# Altium project POP.PrjPcb
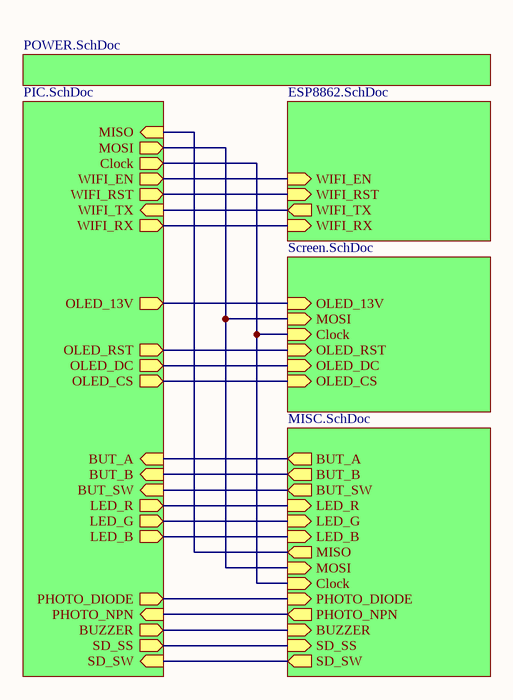
[diagram p0: Root.SchDoc]
6 sheets, 94 parts. Net scope: hierarchical (ports join the sheet entries above them; power ports are global).
Board file: ultratron_PCB.PcbDoc
Sheets:
  Root.SchDoc
     = ESP8862.SchDoc
     = MISC.SchDoc
     = PIC.SchDoc
     = POWER.SchDoc
     = Screen.SchDoc

## Sheet Root.SchDoc
size A4; SheetNumber: 0

### Sub-sheets
? = ESP8862.SchDoc: WIFI_TX (out), WIFI_RX (in), WIFI_RST (in), WIFI_EN (in)
? = MISC.SchDoc: BUT_A (out), BUT_B (out), BUT_SW (out), LED_R (in), LED_G (in), LED_B (in), SD_SS (in), MISO (out), MOSI (in), Clock (in), PHOTO_DIODE (in), PHOTO_NPN (out), BUZZER (in), SD_SW (out)
? = PIC.SchDoc: OLED_RST (out), OLED_13V (out), BUZZER (out), MISO (in), MOSI (out), SD_SS (out), OLED_DC (out), OLED_CS (out), WIFI_RST (out), LED_R (out), LED_B (out), LED_G (out), PHOTO_DIODE (out), BUT_A (in), SD_SW (in), Clock (out), BUT_SW (in), BUT_B (in), WIFI_RX (out), WIFI_TX (in), PHOTO_NPN (in), WIFI_EN (out)
? = POWER.SchDoc: no entries
? = Screen.SchDoc: OLED_13V (in), MOSI (in), Clock (in), OLED_RST (in), OLED_CS (in), OLED_DC (in)

### Nets
PIC_RX: sheet /WIFI_TX, sheet /WIFI_TX
PIC_TX: sheet /WIFI_RX, sheet /WIFI_RX
NetA1_1: sheet /PHOTO_NPN, sheet /PHOTO_NPN
NetC25_2: sheet /BUT_SW, sheet /BUT_SW
NetC26_2: sheet /BUT_A, sheet /BUT_A
NetC27_2: sheet /BUT_B, sheet /BUT_B
NetDS1_8: sheet /OLED_CS, sheet /OLED_CS
NetDS1_9: sheet /OLED_RST, sheet /OLED_RST
NetDS1_10: sheet /OLED_DC, sheet /OLED_DC
NetDS1_13: sheet /Clock, sheet /Clock, sheet /Clock
NetDS1_14: sheet /MOSI, sheet /MOSI, sheet /MOSI
NetJ2_2: sheet /SD_SS, sheet /SD_SS
NetJ2_7: sheet /MISO, sheet /MISO
NetJ2_SWA: sheet /SD_SW, sheet /SD_SW
NetQ1_1: sheet /OLED_13V, sheet /OLED_13V
NetQ3_1: sheet /LED_R, sheet /LED_R
NetQ4_1: sheet /LED_G, sheet /LED_G
NetQ5_1: sheet /LED_B, sheet /LED_B
NetQ6_1: sheet /BUZZER, sheet /BUZZER
NetQ7_1: sheet /PHOTO_DIODE, sheet /PHOTO_DIODE
NetR19_1: sheet /WIFI_RST, sheet /WIFI_RST
NetR21_1: sheet /WIFI_EN, sheet /WIFI_EN

## Sheet ESP8862.SchDoc
size A4; SheetNumber: 3
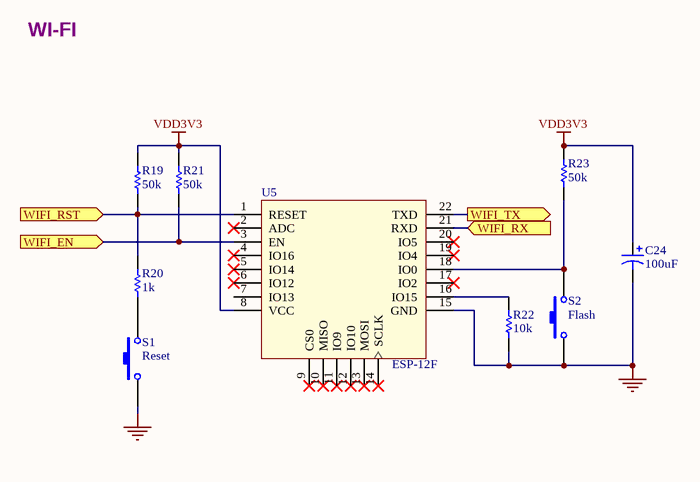
[diagram p1: ESP8862.SchDoc]

### Parts
C24  100uF  [AVX-B_TANTALUM-SMD-100UF-6.3V(AVX-B)(Primary)]
R19  50k  [RESC1608X55N]
R20  1k  [RESC1608X55N]
R21  50k  [RESC1608X55N]
R22  10k  [RESC1608X55N]
R23  50k  [RESC1608X55N]
S1  Reset  [SWITCH_4x6]
S2  Flash  [SWITCH_4x6]
U5  ESP-12F  [ESP_12_E]

### Ports
WIFI_EN (in), WIFI_RST (in), WIFI_RX (in), WIFI_TX (out)

### Nets
GND: C24.2 R22.1 S1.1 S2.1 U5.15(GND)
VDD3V3: C24.1 R19.2 R21.2 R23.2 U5.8(VCC)
PIC_RX: U5.22(TXD) ; port WIFI_TX
PIC_TX: U5.21(RXD) ; port WIFI_RX
NetR19_1: R19.1 R20.2 U5.1(RESET) ; port WIFI_RST
NetR20_1: R20.1 S1.2
NetR21_1: R21.1 U5.3(EN) ; port WIFI_EN
NetR22_2: R22.2 U5.16(IO15)
NetR23_1: R23.1 S2.2 U5.18(IO0)

Not connected (* = marked no-connect by the designer): U5 2(ADC)* 4(IO16)* 5(IO14)* 6(IO12)* 7(IO13) 9(CS0)* 10(MISO)* 11(IO9)* 12(IO10)* 13(MOSI)* 14(SCLK)* 17(IO2)* 19(IO4)* 20(IO5)*

### Notes on the sheet
- WI-FI

### Library data of the parts
C24 = Cap Pol2: Polarized Capacitor (Axial); Fabricant: AVX; Fabricant_REF: TAJB107M006RNJ; Fournisseur: Farnell; Fournisseur_REF: 1833917; Price: 0.914
R19-R21 R23 = Resistor: Fabricant: MULTICOMP; Fournisseur: Farnell
R22 = Resistor: Value: 1K; Published: 8-Jun-2000; LatestRevisionDate: 17-Jul-2002; LatestRevisionNote: Re-released for DXP Platform.; PackageReference: AXIAL-0.3; Publisher: Altium Limited; PackageDescription: Axial Device, Thru-Hole; 2 Leads; 0.3 in Pin Spacing
S1 S2 = SW-PB: Switch; Fabricant: FGHGF; Fabricant_REF: 1158238; Fournisseur: Aliexpress; Fournisseur_REF: 32788506240; Price: 0.0211
U5 = ESP-12F: Fabricant: ESPRESSIF; Fournisseur: Aliexpress; Fournisseur_REF: 32858988324; Price: 1.6; Fabricant_REF: ESP-12F

## Sheet MISC.SchDoc
size A4; SheetNumber: 5
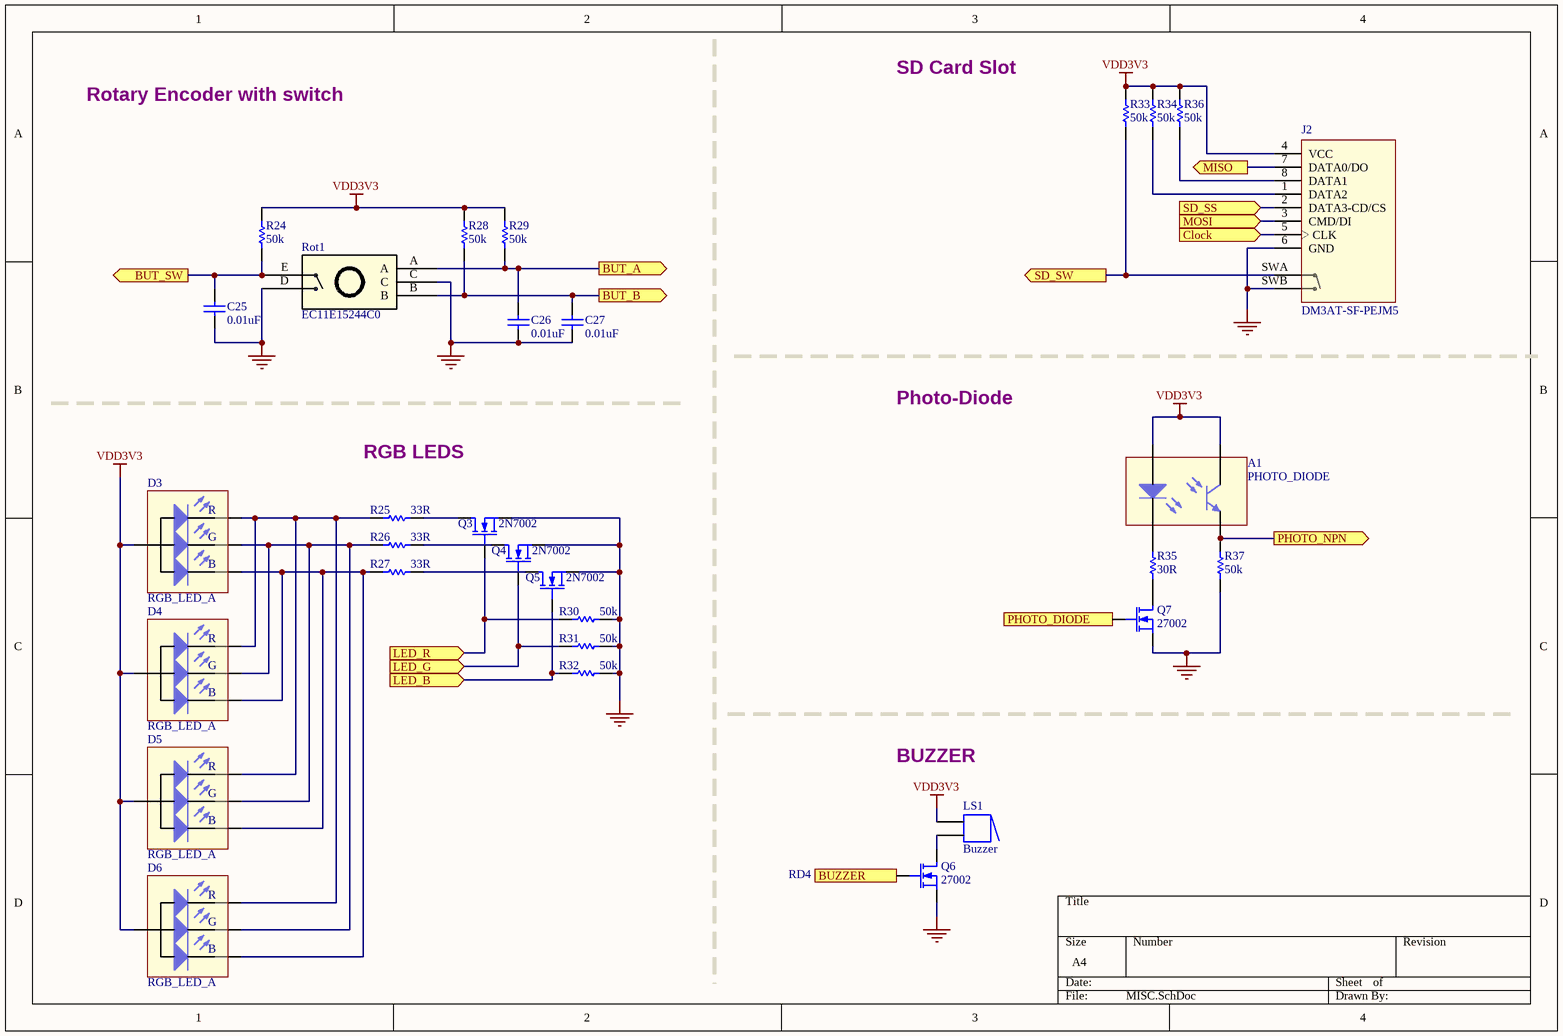
[diagram p2: MISC.SchDoc]

### Parts
A1  PHOTO_DIODE  [TCRT5000]
C25  0.01uF  [CAPC1608X90N]
C26  0.01uF  [CAPC1608X90N]
C27  0.01uF  [CAPC1608X90N]
D3  RGB_LED_A  [RGB_LED]
D4  RGB_LED_A  [RGB_LED]
D5  RGB_LED_A  [RGB_LED]
D6  RGB_LED_A  [RGB_LED]
J2  DM3AT-SF-PEJM5  [HRS_DM3AT-SF-PEJM5_DM3AT-SF-PEJM5(Primary)]
LS1  Buzzer  [ABT-460-RC]
Q3  2N7002  [SOT23-3]
Q4  2N7002  [SOT23-3]
Q5  2N7002  [SOT23-3]
Q6  27002  [SOT23-3]
Q7  27002  [SOT23-3]
R24  50k  [RESC1608X55N]
R25  33R  [RESC1608X55N]
R26  33R  [RESC1608X55N]
R27  33R  [RESC1608X55N]
R28  50k  [RESC1608X55N]
R29  50k  [RESC1608X55N]
R30  50k  [RESC1608X55N]
R31  50k  [RESC1608X55N]
R32  50k  [RESC1608X55N]
R33  50k  [RESC1608X55N]
R34  50k  [RESC1608X55N]
R35  30R  [RESC1608X55N]
R36  50k  [RESC1608X55N]
R37  50k  [RESC1608X55N]
Rot1  EC11E15244C0  [EC11E15244C0]

### Ports
BUT_A (out), BUT_B (out), BUT_SW (out), BUZZER (in), Clock (in), LED_B (in), LED_G (in), LED_R (in), MISO (out), MOSI (in), PHOTO_DIODE (in), PHOTO_NPN (out), SD_SS (in), SD_SW (out)

### Nets
GND: C25.1 C26.1 C27.1 J2.6(GND) J2.SWB(B) Q3.2(S) Q4.2(S) Q5.2(S) Q6.2(S) Q7.2(S) R30.2 R31.2 R32.2 R37.1 Rot1.C Rot1.D(Switch)
VDD3V3: A1.2 A1.3 D3.2(Cathode) D4.2(Cathode) D5.2(Cathode) D6.2(Cathode) J2.4(VCC) LS1.1 R24.2 R28.2 R29.2 R33.2 R34.2 R36.2
NetA1_1: A1.1 R37.2 ; port PHOTO_NPN
NetA1_4: A1.4 R35.2
NetC25_2: C25.2 R24.1 Rot1.E(Switch) ; port BUT_SW
NetC26_2: C26.2 R29.1 Rot1.A ; port BUT_A
NetC27_2: C27.2 R28.1 Rot1.B ; port BUT_B
NetD3_1: D3.1(R) D4.1(R) D5.1(R) D6.1(R) R25.1
NetD3_3: D3.3(G) D4.3(G) D5.3(G) D6.3(G) R26.1
NetD3_4: D3.4(B) D4.4(B) D5.4(B) D6.4(B) R27.1
NetDS1_13: J2.5(CLK) ; port Clock
NetDS1_14: J2.3(CMD/DI) ; port MOSI
NetJ2_1: J2.1(DATA2) R34.1
NetJ2_2: J2.2(DATA3-CD/CS) ; port SD_SS
NetJ2_7: J2.7(DATA0/DO) ; port MISO
NetJ2_8: J2.8(DATA1) R36.1
NetJ2_SWA: J2.SWA(A) R33.1 ; port SD_SW
NetLS1_2: LS1.2 Q6.3(D)
NetQ3_1: Q3.1(G) R30.1 ; port LED_R
NetQ3_3: Q3.3(D) R25.2
NetQ4_1: Q4.1(G) R31.1 ; port LED_G
NetQ4_3: Q4.3(D) R26.2
NetQ5_1: Q5.1(G) R32.1 ; port LED_B
NetQ5_3: Q5.3(D) R27.2
NetQ6_1: Q6.1(G) ; port BUZZER
NetQ7_1: Q7.1(G) ; port PHOTO_DIODE
NetQ7_3: Q7.3(D) R35.1

### Notes on the sheet
- Rotary Encoder with switch
- SD Card Slot
- Photo-Diode
- RGB LEDS
- BUZZER
- RD4

### Library data of the parts
A1 = PHOTO_DIODE: Photo-diode; Fabricant: VISHAY; Fournisseur: Farnell; Fournisseur_REF: 1470066; Fabricant_REF: TCRT5000; Price: 0.7
C25-C27 = Capacitor: Value: 100pF; Published: 8-Jun-2000; LatestRevisionDate: 17-Jul-2002; LatestRevisionNote: Re-released for DXP Platform.; PackageReference: RAD-0.3; Publisher: Altium Limited; PackageDescription: Radial Cap, Thru-Hole; 2 Leads; 0.3 in Pin Spacing
D3-D6 = RGB_LED_A: RGB_LED Common Anode; Fournisseur: Aliexpress; Price: 0.004
J2 = DM3AT-SF-PEJM5: DM3 RA SMT microSD memory card push/push; Fabricant: HIROSE(HRS); Fournisseur: Farnell; Fournisseur_REF: 1764374; Fabricant_REF: DM3AT-SF-PEJM5(40); Price: 2.64
LS1 = Buzzer: Magnetic Transducer Buzzer; Fabricant: PRO SIGNAL; Fournisseur: Farnell; Fournisseur_REF: 2783902; Price: 1.55; Fabricant_REF: ABT-460-RC
Q3-Q7 = MOSFET-N: N-Channel MOSFET; Fabricant: NEXPERIA; Fournisseur: Farnell; Fournisseur_REF: 1859847; Fabricant_REF: 2N7002BK; Price: 0.196
R24-R37 = Resistor: as R19 on sheet ESP8862
Rot1 = EC11E15244C0: Rotary Encoder; Fabricant: ALPS; Fournisseur: Farnell; Fournisseur_REF: 1520806; Price: 3.32; Fabricant_REF: EC11E15244C0

## Sheet PIC.SchDoc
size A4; SheetNumber: 1
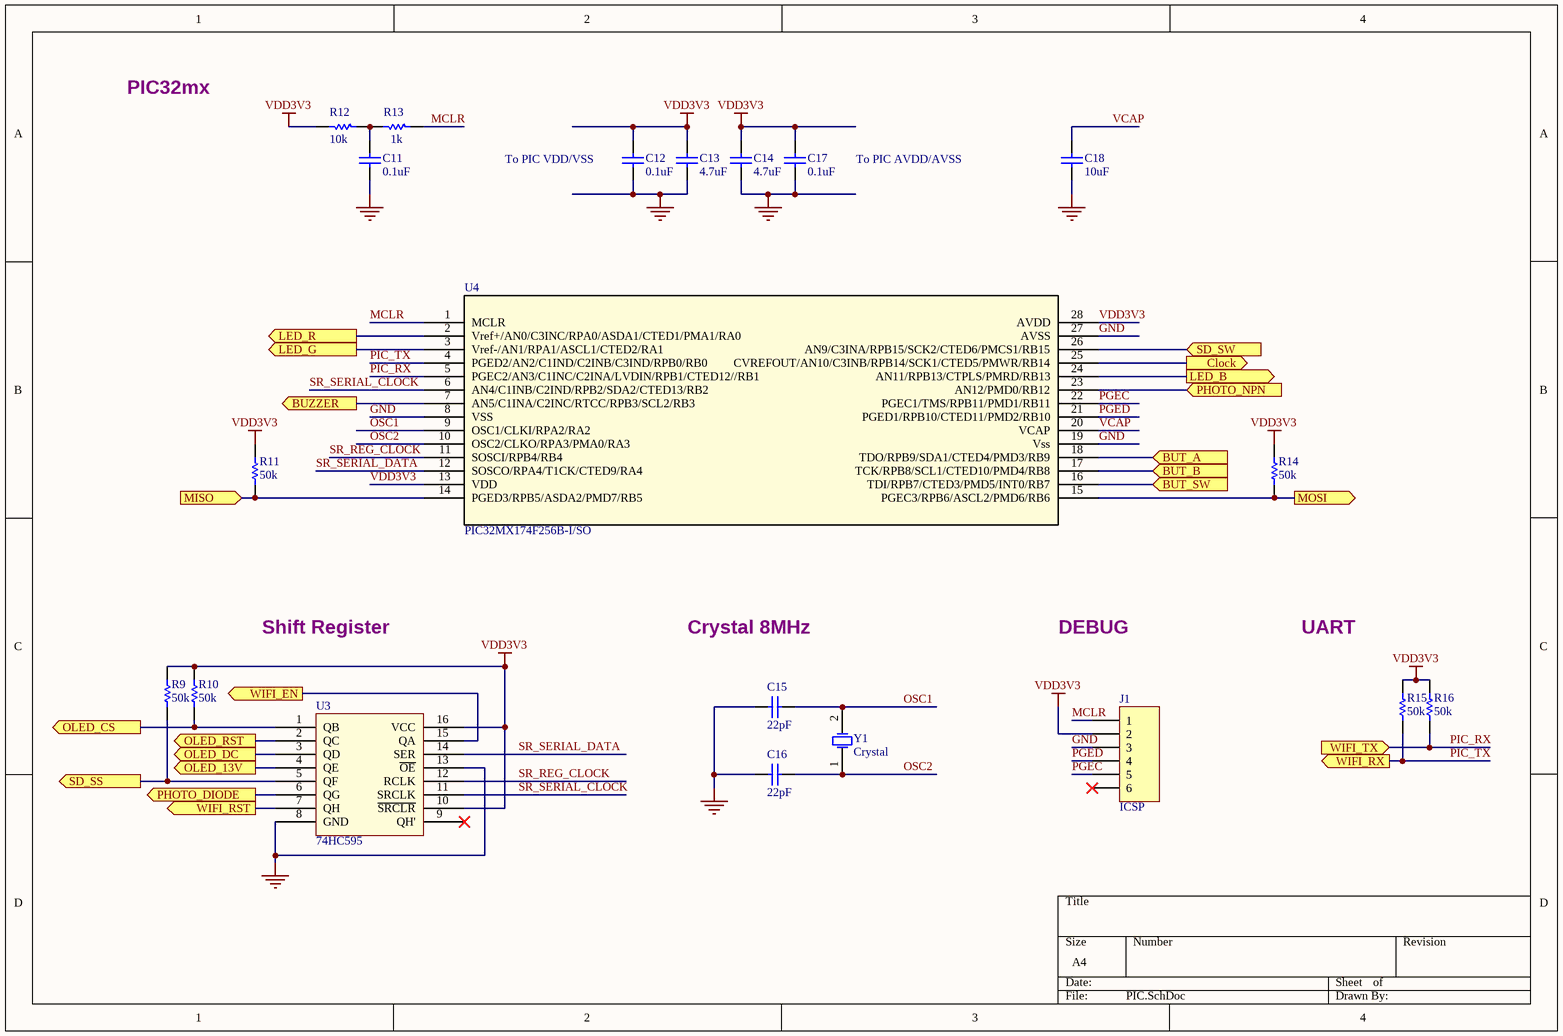
[diagram p3: PIC.SchDoc]

### Parts
C11  0.1uF  [CAPC1608X90N]
C12  0.1uF  [CAPC1608X90N]
C13  4.7uF  [CAPC1608X90N]
C14  4.7uF  [CAPC1608X90N]
C15  22pF  [CAPC1608X90N]
C16  22pF  [CAPC1608X90N]
C17  0.1uF  [CAPC1608X90N]
C18  10uF  [CAPC1608X90N]
J1  ICSP  [ICSP_HEADER]
R9  50k  [RESC1608X55N]
R10  50k  [RESC1608X55N]
R11  50k  [RESC1608X55N]
R12  10k  [RESC1608X55N]
R13  1k  [RESC1608X55N]
R14  50k  [RESC1608X55N]
R15  50k  [RESC1608X55N]
R16  50k  [RESC1608X55N]
U3  74HC595  [SOIC-16]
U4  PIC32MX174F256B-I/SO  [SOIC-28]
Y1  Crystal  [9C]

### Ports
BUT_A (in), BUT_B (in), BUT_SW (in), BUZZER (out), Clock (out), LED_B (out), LED_G (out), LED_R (out), MISO (in), MOSI (out), OLED_13V (out), OLED_CS (out), OLED_DC (out), OLED_RST (out), PHOTO_DIODE (out), PHOTO_NPN (in), SD_SS (out), SD_SW (in), WIFI_EN (out), WIFI_RST (out), WIFI_RX (out), WIFI_TX (in)

### Nets
GND: C11.1 C12.1 C13.1 C14.1 C15.2 C16.2 C17.1 C18.1 J1.3 U3.8(GND) U3.13(~{OE}) U4.8(VSS) U4.19(Vss) U4.27(AVSS)
VDD3V3: C12.2 C13.2 C14.2 C17.2 J1.2 R9.2 R10.2 R11.2 R12.2 R14.2 R15.2 R16.2 U3.10(~{SRCLR}) U3.16(VCC) U4.13(VDD) U4.28(AVDD)
MCLR: J1.1 R13.1 U4.1(MCLR)
OSC1: C15.1 U4.9(OSC1/CLKI/RPA2/RA2) Y1.2
OSC2: C16.1 U4.10(OSC2/CLKO/RPA3/PMA0/RA3) Y1.1
PGEC: J1.5 U4.22(PGEC1/TMS/RPB11/PMD1/RB11)
PGED: J1.4 U4.21(PGED1/RPB10/CTED11/PMD2/RB10)
PIC_RX: R16.1 U4.5(PGEC2/AN3/C1INC/C2INA/LVDIN/RPB1/CTED12//RB1) ; port WIFI_TX
PIC_TX: R15.1 U4.4(PGED2/AN2/C1IND/C2INB/C3IND/RPB0/RB0) ; port WIFI_RX
SR_REG_CLOCK: U3.12(RCLK) U4.11(SOSCI/RPB4/RB4)
SR_SERIAL_CLOCK: U3.11(SRCLK) U4.6(AN4/C1INB/C2IND/RPB2/SDA2/CTED13/RB2)
SR_SERIAL_DATA: U3.14(SER) U4.12(SOSCO/RPA4/T1CK/CTED9/RA4)
VCAP: C18.2 U4.20(VCAP)
NetA1_1: U4.23(AN12/PMD0/RB12) ; port PHOTO_NPN
NetC11_2: C11.2 R12.1 R13.2
NetC25_2: U4.16(TDI/RPB7/CTED3/PMD5/INT0/RB7) ; port BUT_SW
NetC26_2: U4.18(TDO/RPB9/SDA1/CTED4/PMD3/RB9) ; port BUT_A
NetC27_2: U4.17(TCK/RPB8/SCL1/CTED10/PMD4/RB8) ; port BUT_B
NetDS1_8: R10.1 U3.1(QB) ; port OLED_CS
NetDS1_9: U3.2(QC) ; port OLED_RST
NetDS1_10: U3.3(QD) ; port OLED_DC
NetDS1_13: U4.25(CVREFOUT/AN10/C3INB/RPB14/SCK1/CTED5/PMWR/RB14) ; port Clock
NetDS1_14: R14.1 U4.15(PGEC3/RPB6/ASCL2/PMD6/RB6) ; port MOSI
NetJ2_2: R9.1 U3.5(QF) ; port SD_SS
NetJ2_7: R11.1 U4.14(PGED3/RPB5/ASDA2/PMD7/RB5) ; port MISO
NetJ2_SWA: U4.26(AN9/C3INA/RPB15/SCK2/CTED6/PMCS1/RB15) ; port SD_SW
NetQ1_1: U3.4(QE) ; port OLED_13V
NetQ3_1: U4.2(Vref+/AN0/C3INC/RPA0/ASDA1/CTED1/PMA1/RA0) ; port LED_R
NetQ4_1: U4.3(Vref-/AN1/RPA1/ASCL1/CTED2/RA1) ; port LED_G
NetQ5_1: U4.24(AN11/RPB13/CTPLS/PMRD/RB13) ; port LED_B
NetQ6_1: U4.7(AN5/C1INA/C2INC/RTCC/RPB3/SCL2/RB3) ; port BUZZER
NetQ7_1: U3.6(QG) ; port PHOTO_DIODE
NetR19_1: U3.7(QH) ; port WIFI_RST
NetR21_1: U3.15(QA) ; port WIFI_EN

Not connected (* = marked no-connect by the designer): J1 6*; U3 9(QH')*

### Notes on the sheet
- PIC32mx
- (near C12) To PIC VDD/VSS
- To PIC AVDD/AVSS
- Shift Register
- Crystal 8MHz
- DEBUG
- UART

### Library data of the parts
C11-C14 C17 = Capacitor: Ceramic; Fabricant: MURATA; Fournisseur: Farnell
C15 C16 C18 = Capacitor: Fabricant: MURATA; Fournisseur: Farnell
J1 = Header 6: Header, 6-Pin; Fabricant: MOLEX; Fournisseur: Farnell; Fournisseur_REF: 9733078; Fabricant_REF: 53047-0610; Price: 0.403
R9 R10 = Resistor: Value: 1K; Published: 8-Jun-2000; LatestRevisionDate: 17-Jul-2002; LatestRevisionNote: Re-released for DXP Platform.; PackageReference: AXIAL-0.3; Publisher: Altium Limited; PackageDescription: Axial Device, Thru-Hole; 2 Leads; 0.3 in Pin Spacing
R11-R16 = Resistor: as R19 on sheet ESP8862
U3 = 74HC595: Shift Register
U4 = PIC32MX174F256B-I/SO: PIC32; Fabricant: MICROCHIP; Fournisseur: Farnell; Fournisseur_REF: 2775021; Price: 3,84; Fabricant_REF: PIC32MX174F256B-I/SO
Y1 = Crystal: Crystal Oscillator; Fabricant: TXC; Fournisseur: Farnell; Fournisseur_REF: 1842347; Fabricant_REF: 9C-8.000MEEJ-T; Price: 0.604

## Sheet POWER.SchDoc
size A4; SheetNumber: 2
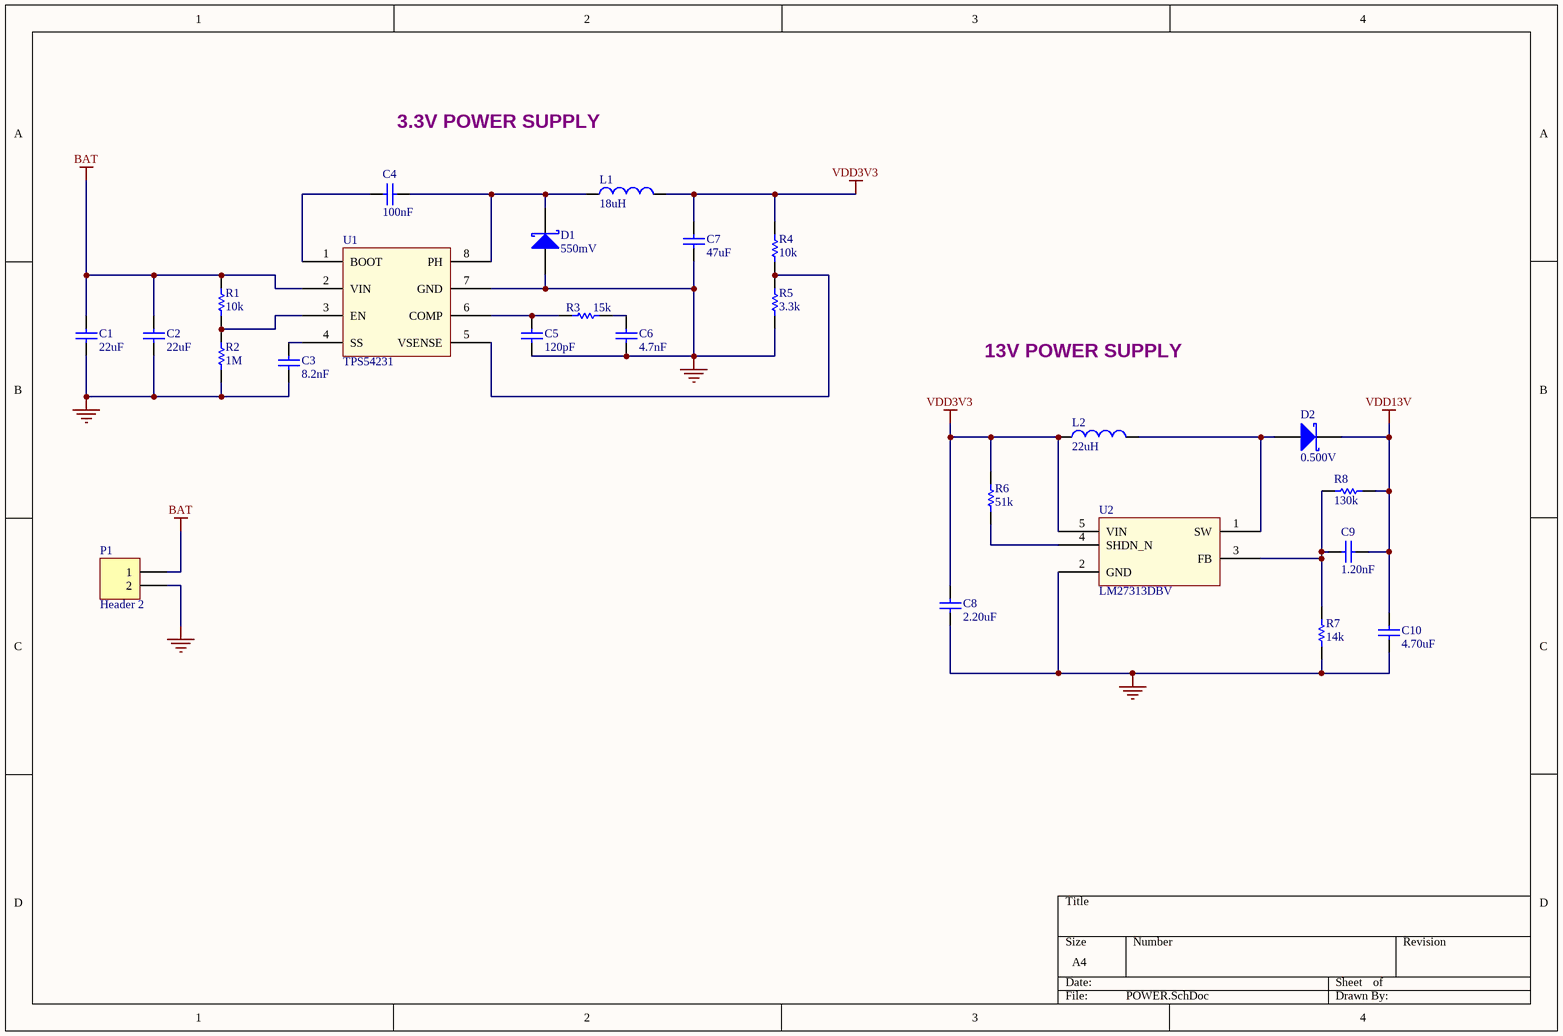
[diagram p4: POWER.SchDoc]

### Parts
C1  22uF  [CAPC1608X90N]
C2  22uF  [CAPC1608X90N]
C3  8.2nF  [CAPC1608X90N]
C4  100nF  [CAPC1608X90N]
C5  120pF  [CAPC1608X90N]
C6  4.7nF  [CAPC1608X90N]
C7  47uF  [CAPMP7343X310N]
C8  2.20uF  [CAPC1608X90N]
C9  1.20nF  [CAPC1608X90N]
C10  4.70uF  [CAPC1608X90N]
D1  550mV  [SOD123]
D2  0.500V  [SOD123]
L1  18uH  [SD43 Inductor]
L2  22uH  [ME3220 Inductor]
P1  Header 2  [2477]
R1  10k  [RESC1608X55N]
R2  1M  [RESC1608X55N]
R3  15k  [RESC1608X55N]
R4  10k  [RESC1608X55N]
R5  3.3k  [RESC1608X55N]
R6  51k  [RESC1608X55N]
R7  14k  [RESC1608X55N]
R8  130k  [RESC1608X55N]
U1  TPS54231  [SOIC-8]
U2  LM27313DBV  [SOT23-5]

### Nets
BAT: C1.2 C2.2 P1.1 R1.1 U1.2(VIN)
GND: C1.1 C2.1 C3.1 C5.1 C6.1 C7.1 C8.1 C10.1 D1.1(A) P1.2 R2.2 R5.1 R7.1 U1.7(GND) U2.2(GND)
VDD3V3: C7.2 C8.2 L1.2 L2.1 R4.2 R6.2 U2.5(VIN)
VDD13V: C9.2 C10.2 D2.2(K) R8.2
NetC3_2: C3.2 U1.4(SS)
NetC4_1: C4.1 D1.2(K) L1.1 U1.8(PH)
NetC4_2: C4.2 U1.1(BOOT)
NetC5_2: C5.2 R3.2 U1.6(COMP)
NetC6_2: C6.2 R3.1
NetC9_1: C9.1 R7.2 R8.1 U2.3(FB)
NetD2_1: D2.1(A) L2.2 U2.1(SW)
NetR1_2: R1.2 R2.1 U1.3(EN)
NetR4_1: R4.1 R5.2 U1.5(VSENSE)
NetR6_1: R6.1 U2.4(SHDN_N)

### Notes on the sheet
- 3.3V POWER SUPPLY
- 13V POWER SUPPLY

### Library data of the parts
C1 C2 = Capacitor: 50V; Fabricant: MURATA; Fournisseur: Farnell; Fournisseur_REF: 2672212; Fabricant_REF: GRT31CR61E226KE01L; Price: 1,33
C3 C6 = Capacitor: 25V; Fabricant: MURATA; Fournisseur: Farnell
C4 = Capacitor: 10V; Fabricant: MURATA; Fournisseur: Farnell
C5 C9 = Capacitor: 50V; Fabricant: MURATA; Fournisseur: Farnell
C7 = Capacitor: GRM32ER60J476ME20L 3225 !; Fabricant: KEMET; Fournisseur: Farnell; Fournisseur_REF: 1457517; Fabricant_REF: T491D476K025AT; Price: 1.9
C8 = Capacitor: 6.3V; Fabricant: MURATA; Fournisseur: Farnell
C10 = Capacitor: Fabricant: MURATA; Fournisseur: Farnell
D1 = D_ZENER: Diode; Fabricant: ON SEMICONDUCTOR; Fabricant_REF: SS24FL; Fournisseur: Farnell; Fournisseur_REF: 2822566; Price: 0.297
D2 = D_ZENER: Diode; Fabricant: DIODES INC; Fabricant_REF: B130LAW-7-F; Fournisseur: Farnell; Fournisseur_REF: 1858617; Price: 0.302
L1 = Inductor: Fabricant: COILCRAFT; Fournisseur: Farnell; Fournisseur_REF: 2526954; Fabricant_REF: SD43-183MLB; Price: 0.921
L2 = Inductor: Fabricant: COILCRAFT; Fabricant_REF: ME3220-223KLB; Fournisseur: Farnell; Fournisseur_REF: 2287928; Price: 0.661
P1 = Header 2: Header, 2-Pin; Fabricant: KEYSTONE; Fournisseur: Farnell; Fournisseur_REF: 1650684; Fabricant_REF: 2477; Price: 1.41
R1-R6 R8 = Resistor: as R19 on sheet ESP8862
R7 = Resistor: Fabricant: MULTICOMP; Fournisseur: Farnell; Fournisseur_REF: 2447252; Fabricant_REF: MCWR06X1402FTL; Price: 0.0036
U1 = TPS54231: Fabricant: TEXAS INSTRUMENTS; Fabricant_REF: TPS54231DR; Fournisseur: Farnell; Fournisseur_REF: 2854681; Price: 1.55
U2 = LM27313DBV: Fabricant: TEXAS INSTRUMENTS; Fabricant_REF: LM27313XMF/NOPB; Fournisseur: Farnell; Fournisseur_REF: 1564771; Price: 1.27

## Sheet Screen.SchDoc
size A4; SheetNumber: 4
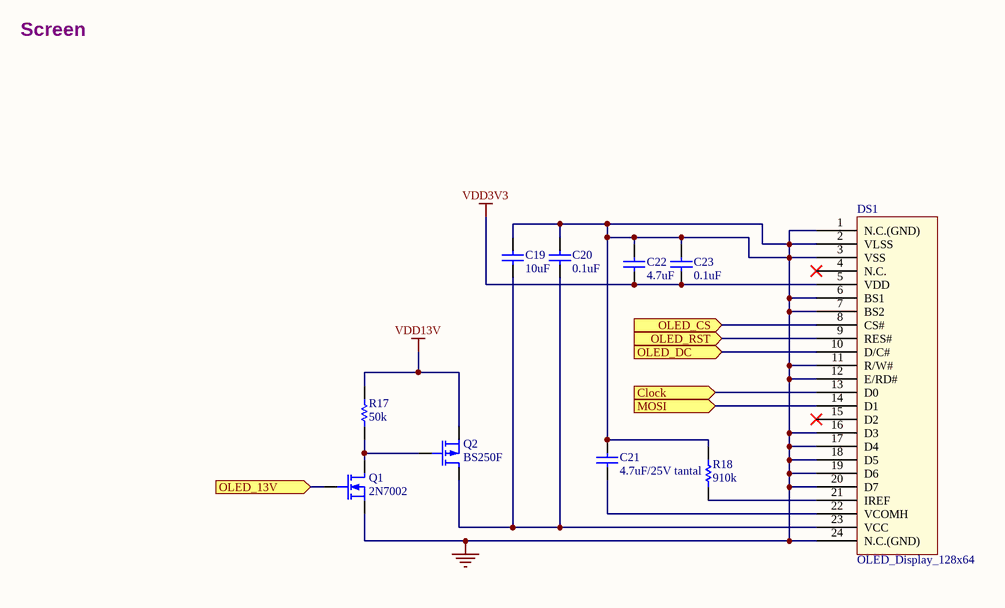
[diagram p5: Screen.SchDoc]

### Parts
C19  10uF  [CAPC1608X90N]
C20  0.1uF  [CAPC1608X90N]
C21  4.7uF/25V tantal  [CAPMP3216X180N]
C22  4.7uF  [CAPC2012X135N]
C23  0.1uF  [CAPC2012X135N]
DS1  OLED_Display_128x64  [HRS_FH12-24S-0.5SH(55)]
Q1  2N7002  [SOT23-3]
Q2  BS250F  [SOT23-3]
R17  50k  [RESC1608X55N]
R18  910k  [RESC1608X55N]

### Ports
Clock (in), MOSI (in), OLED_13V (in), OLED_CS (in), OLED_DC (in), OLED_RST (in)

### Nets
GND: C19.2 C20.1 C21.1 C22.2 C23.1 DS1.1(N.C.(GND)) DS1.2(VLSS) DS1.3(VSS) DS1.6(BS1) DS1.7(BS2) DS1.11(R/W#) DS1.12(E/RD#) DS1.16(D3) DS1.17(D4) DS1.18(D5) DS1.19(D6) DS1.20(D7) DS1.24(N.C.(GND)) Q1.2(S) R18.1
VDD3V3: C22.1 C23.2 DS1.5(VDD)
VDD13V: Q2.2(S) R17.2
NetC19_1: C19.1 C20.2 DS1.23(VCC) Q2.3(D)
NetC21_2: C21.2 DS1.22(VCOMH)
NetDS1_8: DS1.8(CS#) ; port OLED_CS
NetDS1_9: DS1.9(RES#) ; port OLED_RST
NetDS1_10: DS1.10(D/C#) ; port OLED_DC
NetDS1_13: DS1.13(D0) ; port Clock
NetDS1_14: DS1.14(D1) ; port MOSI
NetDS1_21: DS1.21(IREF) R18.2
NetQ1_1: Q1.1(G) ; port OLED_13V
NetQ1_3: Q1.3(D) Q2.1(G) R17.1

Not connected (* = marked no-connect by the designer): DS1 4(N.C.)* 15(D2)*

### Notes on the sheet
- Screen

### Library data of the parts
C19 C20 C22 C23 = Capacitor: Fabricant: MURATA; Fournisseur: Farnell
C21 = Capacitor: Fabricant: KEMET; Fournisseur: Farnell; Fournisseur_REF: 2283561; Fabricant_REF: T491D476K025AT; Price: 0.332
DS1 = OLED_Display_128x64: Fabricant: MIDAS; Fabricant_REF: MCOT128064H1V-WM; Fournisseur: Farnell; Fournisseur_REF: 2817924; Price: 18.81
Q1 = MOSFET-N: as Q3 on sheet MISC; Price: 0.196
Q2 = MOSFET-P: P-Channel MOSFET; Fabricant: DIODES INC; Fournisseur: Farnell; Fournisseur_REF: 1843731; Fabricant_REF: BS250FTA; Price: 0.539
R17 R18 = Resistor: as R19 on sheet ESP8862

## Nets that join several sheets
GND: ESP8862 (5 pins), MISC (16 pins), PIC (14 pins), POWER (15 pins), Screen (20 pins)
VDD3V3: ESP8862 (5 pins), MISC (14 pins), PIC (16 pins), POWER (7 pins), Screen (C22.1 C23.2 DS1.5)
VDD13V: POWER (C9.2 C10.2 D2.2 R8.2), Screen (Q2.2 R17.2)
NetA1_1: MISC (A1.1 R37.2), PIC (U4.23)
NetC25_2: MISC (C25.2 R24.1 Rot1.E), PIC (U4.16)
NetC26_2: MISC (C26.2 R29.1 Rot1.A), PIC (U4.18)
NetC27_2: MISC (C27.2 R28.1 Rot1.B), PIC (U4.17)
NetDS1_8: PIC (R10.1 U3.1), Screen (DS1.8)
NetDS1_9: PIC (U3.2), Screen (DS1.9)
NetDS1_10: PIC (U3.3), Screen (DS1.10)
NetDS1_13: MISC (J2.5), PIC (U4.25), Screen (DS1.13)
NetDS1_14: MISC (J2.3), PIC (R14.1 U4.15), Screen (DS1.14)
NetJ2_2: MISC (J2.2), PIC (R9.1 U3.5)
NetJ2_7: MISC (J2.7), PIC (R11.1 U4.14)
NetJ2_SWA: MISC (J2.SWA R33.1), PIC (U4.26)
NetQ1_1: PIC (U3.4), Screen (Q1.1)
NetQ3_1: MISC (Q3.1 R30.1), PIC (U4.2)
NetQ4_1: MISC (Q4.1 R31.1), PIC (U4.3)
NetQ5_1: MISC (Q5.1 R32.1), PIC (U4.24)
NetQ6_1: MISC (Q6.1), PIC (U4.7)
NetQ7_1: MISC (Q7.1), PIC (U3.6)
NetR19_1: ESP8862 (R19.1 R20.2 U5.1), PIC (U3.7)
NetR21_1: ESP8862 (R21.1 U5.3), PIC (U3.15)
PIC_RX: ESP8862 (U5.22), PIC (R16.1 U4.5)
PIC_TX: ESP8862 (U5.21), PIC (R15.1 U4.4)